# EAGLE design FemtecTester (EAGLE 6.5.0)
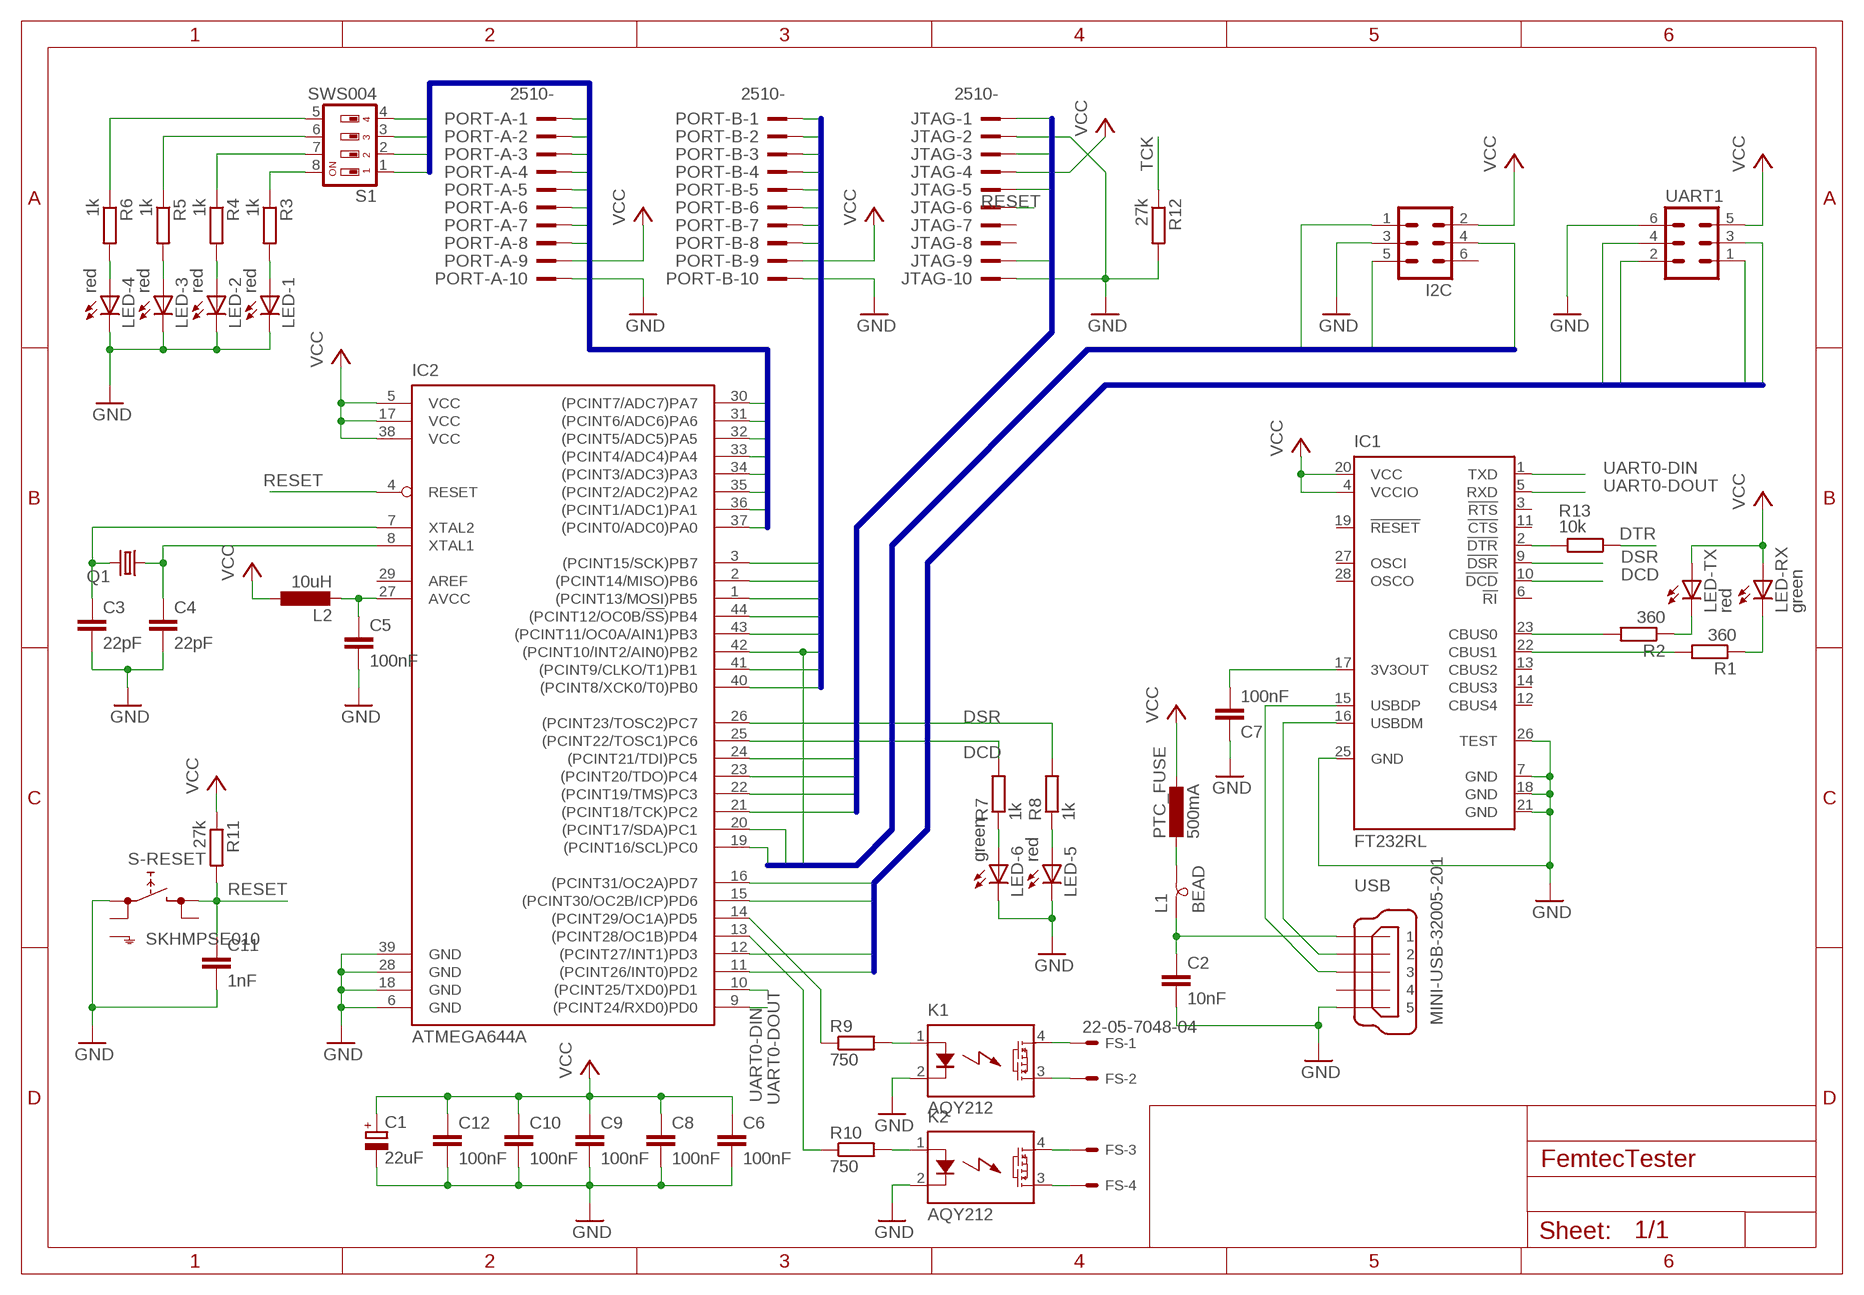
[diagram p0: schematic, sheet 1]

## Parts
C1  22uF  CPOL-EUSMCD  [SMC_D]
C2  10nF  C-EUC1206K  [C1206K]
C3  22pF  C-EUC1206K  [C1206K]
C4  22pF  C-EUC1206K  [C1206K]
C5  100nF  C-EUC1206K  [C1206K]
C6  100nF  C-EUC1206K  [C1206K]
C7  100nF  C-EUC1206K  [C1206K]
C8  100nF  C-EUC1206K  [C1206K]
C9  100nF  C-EUC1206K  [C1206K]
C10  100nF  C-EUC1206K  [C1206K]
C11  1nF  C-EUC1206K  [C1206K]
C12  100nF  C-EUC1206K  [C1206K]
FS  22-05-7048-04  [7395-04]
I2C  ML6  [ML6]
IC1  FT232RL  [SSOP28]
IC2  ATMEGA644A  [TQFP44]
JTAG  2510-  [PAK100/2500-10]
K1  AQY212  AQY2212VEHA  [SMD-DIP04]
K2  AQY212  AQY2212VEHA  [SMD-DIP04]
L1  BEAD  SM-B9  [SM-B9]
L2  10uH  L-EUL3230M  [L3230M]
LED-1  red  LEDCHIPLED_1206  [CHIPLED_1206]
LED-2  red  LEDCHIPLED_1206  [CHIPLED_1206]
LED-3  red  LEDCHIPLED_1206  [CHIPLED_1206]
LED-4  red  LEDCHIPLED_1206  [CHIPLED_1206]
LED-5  red  LEDCHIPLED_1206  [CHIPLED_1206]
LED-6  green  LEDCHIPLED_1206  [CHIPLED_1206]
LED-RX  green  LEDCHIPLED_1206  [CHIPLED_1206]
LED-TX  red  LEDCHIPLED_1206  [CHIPLED_1206]
PORT-A  2510-  [PAK100/2500-10]
PORT-B  2510-  [PAK100/2500-10]
PTC_FUSE  500mA  L-EUL1812  [L1812]
Q1  CRYSTALHC49UP  [HC49UP]
R1  360  R-EU_M1206  [M1206]
R2  360  R-EU_M1206  [M1206]
R3  1k  R-EU_M1206  [M1206]
R4  1k  R-EU_M1206  [M1206]
R5  1k  R-EU_M1206  [M1206]
R6  1k  R-EU_M1206  [M1206]
R7  1k  R-EU_M1206  [M1206]
R8  1k  R-EU_M1206  [M1206]
R9  750  R-EU_M1206  [M1206]
R10  750  R-EU_M1206  [M1206]
R11  27k  R-EU_M1206  [M1206]
R12  27k  R-EU_M1206  [M1206]
R13  10k  R-EU_M1206  [M1206]
S1  SWS004  [SMS-004]
S-RESET  SKHMPSE010  [SKHMPXE010]
UART1  ML6  [ML6]
USB  MINI-USB-32005-201  [32005-201]

## Nets
A0: IC2.37((PCINT0/ADC0)PA0) PORT-A.1
A1: IC2.36((PCINT1/ADC1)PA1) PORT-A.2
A2: IC2.35((PCINT2/ADC2)PA2) PORT-A.3
A3: IC2.34((PCINT3/ADC3)PA3) PORT-A.4
A4: IC2.33((PCINT4/ADC4)PA4) PORT-A.5 S1.1
A5: IC2.32((PCINT5/ADC5)PA5) PORT-A.6 S1.2
A6: IC2.31((PCINT6/ADC6)PA6) PORT-A.7 S1.3
A7: IC2.30((PCINT7/ADC7)PA7) PORT-A.8 S1.4
B0: IC2.40((PCINT8/XCK0/T0)PB0) PORT-B.1
B1: IC2.41((PCINT9/CLKO/T1)PB1) PORT-B.2
B2/INT: I2C.5 IC2.42((PCINT10/INT2/AIN0)PB2) PORT-B.3
B3: IC2.43((PCINT11/OC0A/AIN1)PB3) PORT-B.4
B4: IC2.44((PCINT12/OC0B/!SS!)PB4) PORT-B.5
B5: IC2.1((PCINT13/MOSI)PB5) PORT-B.6
B6: IC2.2((PCINT14/MISO)PB6) PORT-B.7
B7: IC2.3((PCINT15/SCK)PB7) PORT-B.8
CTS: IC2.16((PCINT31/OC2A)PD7) UART1.3
DCD: IC1.10(!DCD) IC2.25((PCINT22/TOSC1)PC6) R7.2
DSR: IC1.9(!DSR) IC2.26((PCINT23/TOSC2)PC7) R8.2
DTR: IC2.15((PCINT30/OC2B/ICP)PD6) R13.1 UART1.4
GND: C1.- C2.2 C3.2 C4.2 C5.2 C6.2 C7.2 C8.2 C9.2 C10.2 C11.2 C12.2 I2C.3 IC1.7(GND) IC1.18(GND) IC1.21(GND) IC1.25(GND) IC1.26(TEST) IC2.6(GND) IC2.18(GND) IC2.28(GND) IC2.39(GND) JTAG.2 JTAG.10 K1.2(K) K2.2(K) LED-1.C LED-2.C LED-3.C LED-4.C LED-5.C LED-6.C PORT-A.10 PORT-B.10 R12.2 S-RESET.1(1.1) UART1.6 USB.5
N$1: IC1.16(USBDM) USB.2
N$2: C3.1 IC2.7(XTAL2) Q1.2
N$3: IC1.15(USBDP) USB.3
N$4: C5.1 IC2.27(AVCC) L2.2
N$5: C4.1 IC2.8(XTAL1) Q1.1
N$6: C2.1 L1.1 USB.1
N$7: C7.1 IC1.17(3V3OUT)
N$8: R3.1 S1.8
N$9: R4.1 S1.7
N$10: IC1.23(CBUS0) R2.2
N$11: IC1.22(CBUS1) R1.2
N$12: LED-TX.C R2.1
N$13: LED-RX.C R1.1
N$14: R5.1 S1.6
N$15: R6.1 S1.5
N$16: LED-4.A R6.2
N$17: LED-3.A R5.2
N$18: LED-2.A R4.2
N$19: LED-1.A R3.2
N$20: IC2.13((PCINT28/OC1B)PD4) R10.1
N$23: LED-6.A R7.1
N$24: LED-5.A R8.1
N$25: IC2.14((PCINT29/OC1A)PD5) R9.1
N$26: FS.2 K1.3(DS2)
N$27: FS.1 K1.4(DS1)
N$28: K1.1(A) R9.2
N$29: K2.1(A) R10.2
N$30: L1.2 PTC_FUSE.2
N$31: FS.3 K2.4(DS1)
N$32: FS.4 K2.3(DS2)
N$33: IC1.2(!DTR) R13.2
RESET: C11.1 IC2.4(RESET) JTAG.6 R11.2 S-RESET.3(2.1)
RX: IC2.11((PCINT26/INT0)PD2) UART1.1
SCL: I2C.4 IC2.19((PCINT16/SCL)PC0)
SDA: I2C.1 IC2.20((PCINT17/SDA)PC1)
TCK: IC2.21((PCINT18/TCK)PC2) JTAG.1 R12.1
TDI: IC2.24((PCINT21/TDI)PC5) JTAG.9
TDO: IC2.23((PCINT20/TDO)PC4) JTAG.3
TMS: IC2.22((PCINT19/TMS)PC3) JTAG.5
TX: IC2.12((PCINT27/INT1)PD3) UART1.2
UART0-DIN: IC1.1(TXD) IC2.9((PCINT24/RXD0)PD0)
UART0-DOUT: IC1.5(RXD) IC2.10((PCINT25/TXD0)PD1)
VCC: C1.+ C6.1 C8.1 C9.1 C10.1 C12.1 I2C.2 IC1.4(VCCIO) IC1.20(VCC) IC2.5(VCC) IC2.17(VCC) IC2.38(VCC) JTAG.4 L2.1 LED-RX.A LED-TX.A PORT-A.9 PORT-B.9 PTC_FUSE.1 R11.1 UART1.5
Unconnected: I2C.6 IC1.3(!RTS) IC1.6(!RI) IC1.11(!CTS) IC1.12(CBUS4) IC1.13(CBUS2) IC1.14(CBUS3) IC1.19(!RESET) IC1.27(OSCI) IC1.28(OSCO) IC2.29(AREF) JTAG.7 JTAG.8 S-RESET.2(1.2) S-RESET.4(2.2) S-RESET.5(SH) USB.4

## Buses
A[0..7]
B0,B1,B2/INT,B3,B4,B5,B6,B7
TCK,TDO,TMS,TDI
SDA,SCL,B2/INT
RX,TX,CTS,DTS,DTR

## Library data of the parts
C1 = rcl:CPOL-EU: POLARIZED CAPACITOR, European symbol
C2-C12 = rcl:C-EU: CAPACITOR, European symbol
FS = con-molex:22-?-04: CONNECTOR wire to board 2.54 mm (.1 inch) pitch header; OC_FARNELL: unknown; OC_NEWARK: unknown
I2C UART1 = con-harting-ml:ML6: HARTING; OC_FARNELL: unknown; OC_NEWARK: unknown
IC1 = ftdichip:FT232R: Source: http://www.ftdichip.com/Documents/DataSheets/DS_FT232R_v104.pdf; MPN: FT232RL; OC_FARNELL: 1146032; OC_NEWARK: 91K9918
IC2 = atmel:ATMEGA644: 8-bit Microcontroller with 64K Bytes In-System Programmable Flash Source: http://www.atmel.com/dyn/resources/prod_documents/doc2593.pdf; MPN: ATMEGA644PV-10AU; OC_FARNELL: 1455123; OC_NEWARK: 58M3748
JTAG PORT-A PORT-B = con-3m:2510-: 3M (TM) Pak 100 4-Wall Header Source: 3M; MF: 3M; MPN: 2510-6002UB; OC_FARNELL: 9838244; OC_NEWARK: 46F4725
K1 K2 = tpv:AQY221*2V: PHOTOMOS Relay RF (Radio Frequency) NAiS C . R 10 SSOP Type; Source: http://www.mew-europe.com/.. aqy221_2v.pdf
L1 = inductor-neosid:SM-B: INDUCTOR SMD Bead inductor; OC_FARNELL: unknown; OC_NEWARK: unknown
L2 PTC_FUSE = rcl:L-EU: INDUCTOR, European symbol
LED-1-LED-6 LED-RX LED-TX = led:LED: LED OSRAM: - CHIPLED LG R971, LG N971, LY N971, LG Q971, LY Q971, LO R971, LY R971 LH N974, LH R974 LS Q976, LO Q976, LY Q976 LO Q996 - Hyper CHIPLED LW Q18S LB Q993, LB Q99A, LB R99A - SideLED LS A670, LO A670, LY A670, LG A670, LP A670 LB A673, LV A673, LT A673, LW A673 LH A674 LY A675 LS A676, LA A676, LO A676, LY A676, LW A676 LS A679, LY A679, LG A679 - Hyper Micro SIDELED® LS Y876, LA Y876, LO Y876, LY Y876 LT Y87S - SmartLED LW L88C, LW L88S LB L89C, LB L89S, LG L890 LS L89K, LO L89K, LY L89K LS L896, LA L896, LO L896, LY L896 - TOPLED LS T670, LO T670, LY T670, LG T670, LP T670 LSG T670, LSP T670, LSY T670, LOP T670, LYG T670 LG T671, LOG T671, LSG T671 LB T673, LV T673, LT T673, LW T673 LH T674 LS T676, LA T676, LO T676, LY T676, LB T676, LH T676, LSB T676, LW T676 LB T67C, LV T67C, LT T67C, LS T67K, LO T67K, LY T67K, LW E67C LS E67B, LA E67B, LO E67B, LY E67B, LB E67C, LV E67C, LT E67C LW T67C LS T679, LY T679, LG T679 LS T770, LO T770, LY T770, LG T770, LP T770 LB T773, LV T773, LT T773, LW T773 LH T774 LS E675, LA E675, LY E675, LS T675 LS T776, LA T776, LO T776, LY T776, LB T776 LHGB T686 LT T68C, LB T68C - Hyper Mini TOPLED® LB M676 - Mini TOPLED Santana® LG M470 LS M47K, LO M47K, LY M47K Source: http://www.osram.convergy.de LUXEON: - LUMILED® LXK2-PW12-R00, LXK2-PW12-S00, LXK2-PW14-U00, LXK2-PW14-V00 LXK2-PM12-R00, LXK2-PM12-S00, LXK2-PM14-U00 LXK2-PE12-Q00, LXK2-PE12-R00, LXK2-PE12-S00, LXK2-PE14-T00, LXK2-PE14-U00 LXK2-PB12-K00, LXK2-PB12-L00, LXK2-PB12-M00, LXK2-PB14-N00, LXK2-PB14-P00, LXK2-PB14-Q00 LXK2-PR12-L00, LXK2-PR12-M00, LXK2-PR14-Q00, LXK2-PR14-R00 LXK2-PD12-Q00, LXK2-PD12-R00, LXK2-PD12-S00 LXK2-PH12-R00, LXK2-PH12-S00 LXK2-PL12-P00, LXK2-PL12-Q00, LXK2-PL12-R00 Source: www.luxeon.com KINGBRIGHT: KA-3528ASYC Source: www.kingbright.com
Q1 = crystal:CRYSTAL: CRYSTAL; OC_FARNELL: unknown; OC_NEWARK: unknown
R1-R13 = rcl:R-EU_: RESISTOR, European symbol
S1 = smd-special:SWS004: SMD Dip Switch 4 pol.
S-RESET = switch:SKHMP*E010: 6.2 X 6.5mm TACT Switch (SMD) Source: http://www3.alps.co.jp/WebObjects/catalog.woa/PDF/E/Switch/Tact/SKHM/SKHM.PDF
USB = con-cypressindustries:MINI-USB-: MINI USB-B Conector Source: www.cypressindustries.com; OC_FARNELL: unknown; OC_NEWARK: unknown

## Board
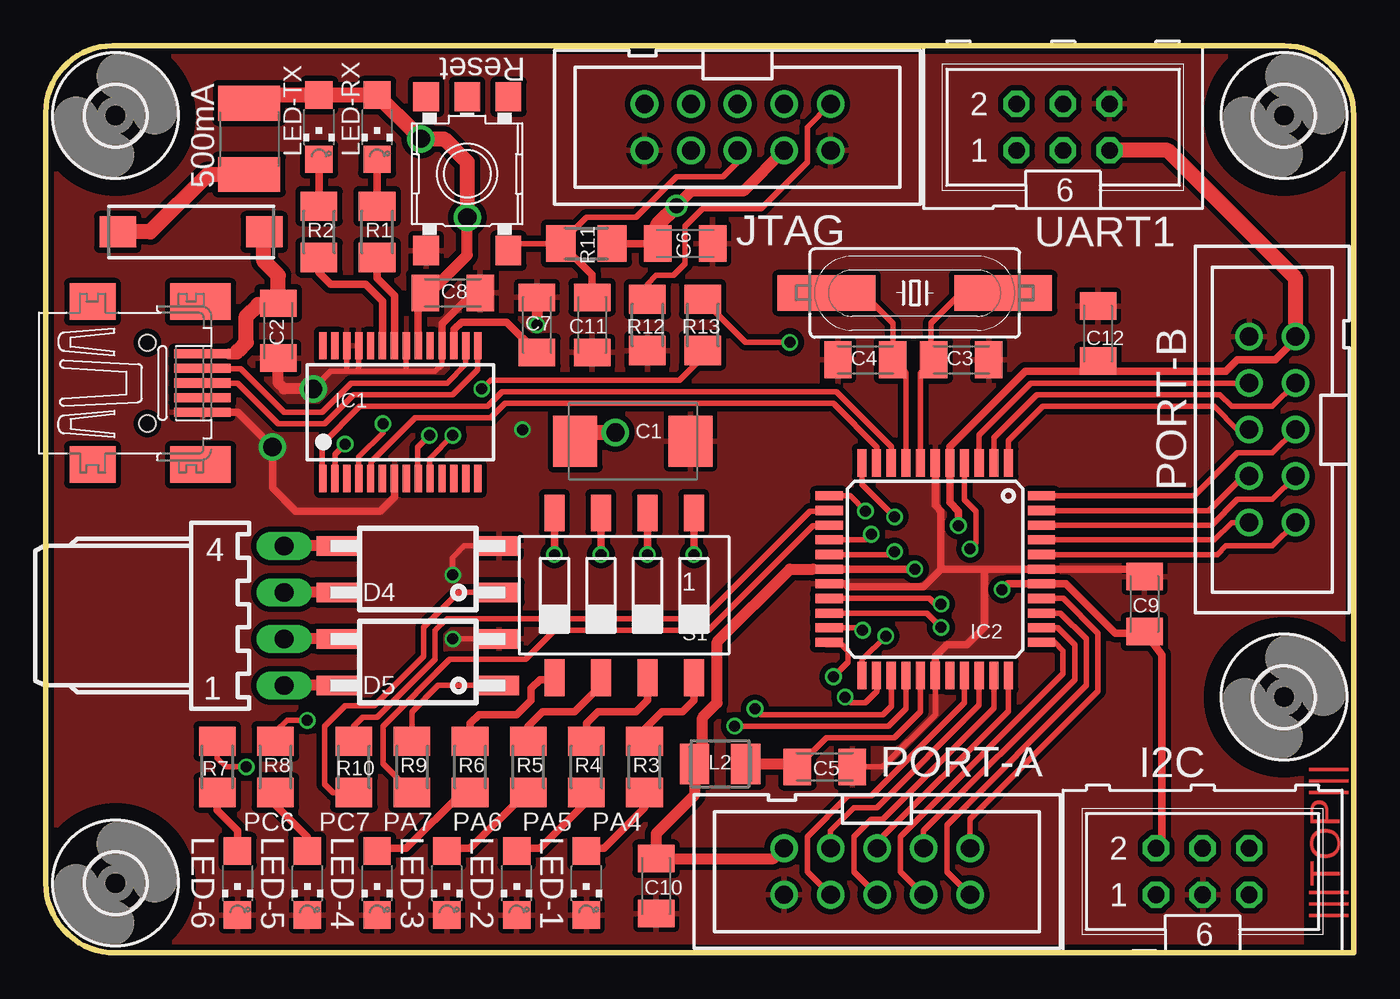
[diagram p1: board, top side]
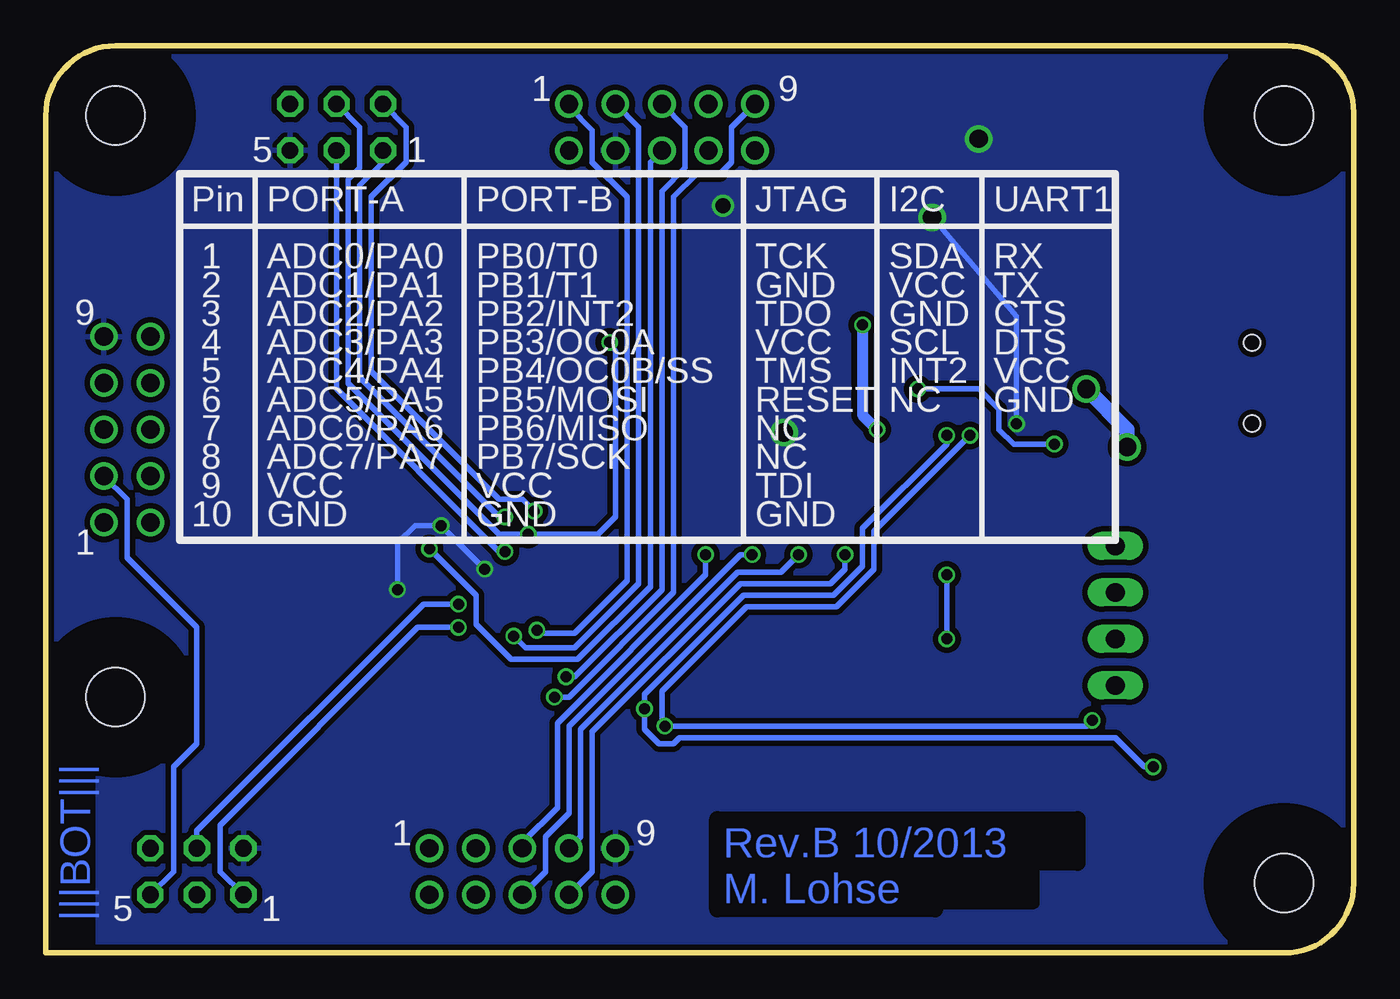
[diagram p2: board, bottom side, seen from below]

Size 71.44 x 49.53 mm. Coordinates in mm from the lower left corner, seen from the top.
Outline: 0,3.81 arc90 3.81,0 71.44,0 71.44,45.72 arc90 67.63,49.53 3.65,49.53 arc90 0,45.88 0,3.81
Copper layers (1*16): Top 0.035mm / dielectric 1.5mm / Bottom 0.035mm
Design rules "ITEADstudio_DRC": minimum track width 6mil, minimum drill 12mil, track to track 6mil, track to pad 6mil, pad to pad 6mil, via to via 6mil, smd to smd 0mil, copper to edge 10mil, drill to drill 10mil, minimum pad ring 10mil, minimum via ring 6mil, stop-mask expansion 2mil, vias tented up to drill 100mil, thermal gap 10mil
bRestrict: 6 lines

### Footprints (pad centres in the part's own frame; a part is rotated, then mirrored left to right if it is on the bottom)
SMC_D = smd 2.4 x 2.8: + -3.15,0; - 3.15,0
C1206K = smd 1.5 x 2: 1 -1.5,0; 2 1.5,0
7395-04 = drill 1.016 long: 1 3.81,0; 2 1.27,0; 3 -1.27,0; 4 -3.81,0
ML6 = drill 0.914 octagon: 1 -2.54,-1.27; 2 -2.54,1.27; 3 0,-1.27; 4 0,1.27; 5 2.54,-1.27; 6 2.54,1.27
SSOP28 = smd 0.4 x 1.5: 1 -4.225,-3.625; 2 -3.575,-3.625; 3 -2.925,-3.625; 4 -2.275,-3.625; 5 -1.625,-3.625; 6 -0.975,-3.625; 7 -0.325,-3.625; 8 0.325,-3.625; 9 0.975,-3.625; 10 1.625,-3.625; 11 2.275,-3.625; 12 2.925,-3.625; 13 3.575,-3.625; 14 4.225,-3.625; 15 4.225,3.625; 16 3.575,3.625; 17 2.925,3.625; 18 2.275,3.625; 19 1.625,3.625; 20 0.975,3.625; 21 0.325,3.625; 22 -0.325,3.625; 23 -0.975,3.625; 24 -1.625,3.625; 25 -2.275,3.625; 26 -2.925,3.625; 27 -3.575,3.625; 28 -4.225,3.625
TQFP44 = smd 1.5 x 0.5: 1 -5.8,4; 2 -5.8,3.2; 3 -5.8,2.4; 4 -5.8,1.6; 5 -5.8,0.8; 6 -5.8,0; 7 -5.8,-0.8; 8 -5.8,-1.6; 9 -5.8,-2.4; 10 -5.8,-3.2; 11 -5.8,-4; 23 5.8,-4; 24 5.8,-3.2; 25 5.8,-2.4; 26 5.8,-1.6; 27 5.8,-0.8; 28 5.8,0; 29 5.8,0.8; 30 5.8,1.6; 31 5.8,2.4; 32 5.8,3.2; 33 5.8,4 | smd 0.5 x 1.5: 12 -4,-5.8; 13 -3.2,-5.8; 14 -2.4,-5.8; 15 -1.6,-5.8; 16 -0.8,-5.8; 17 0,-5.8; 18 0.8,-5.8; 19 1.6,-5.8; 20 2.4,-5.8; 21 3.2,-5.8; 22 4,-5.8; 34 4,5.8; 35 3.2,5.8; 36 2.4,5.8; 37 1.6,5.8; 38 0.8,5.8; 39 0,5.8; 40 -0.8,5.8; 41 -1.6,5.8; 42 -2.4,5.8; 43 -3.2,5.8; 44 -4,5.8
PAK100/2500-10 = drill 1 pad 1.422: 1 -5.08,-1.27; 2 -5.08,1.27; 3 -2.54,-1.27; 4 -2.54,1.27; 5 0,-1.27; 6 0,1.27; 7 2.54,-1.27; 8 2.54,1.27; 9 5.08,-1.27; 10 5.08,1.27
SMD-DIP04 = smd 2.184 x 1.067: 1 -4.445,1.27; 2 -4.445,-1.27; 3 4.445,-1.27; 4 4.445,1.27
SM-B9 = smd 2 x 1.7: 1 -4,0; 2 4,0
L3230M = smd 1.6 x 2.2: 1 -1.4,0; 2 1.4,0
CHIPLED_1206 = smd 1.5 x 1.5: A 0,-1.75; C 0,1.75
L1812 = smd 1.9 x 3.4: 1 -1.95,0; 2 1.95,0
HC49UP = smd 5.334 x 1.93: 1 -4.826,0; 2 4.826,0
M1206 = smd 1.6 x 2: 1 -1.4,0; 2 1.4,0
SMS-004 = smd 1.092 x 2.007: 1 -3.81,-4.496; 2 -1.27,-4.496; 3 1.27,-4.496; 4 3.81,-4.496; 5 3.81,4.496; 6 1.27,4.496; 7 -1.27,4.496; 8 -3.81,4.496
SKHMPXE010 = smd 1.6 x 1.4: 1 -4.2,2.25; 2 4.2,2.25; 3 -4.2,-2.25; 4 4.2,-2.25; 5 4.2,0
3,2 = hole 3.2: 0,0
32005-201 = smd 3.1 x 0.5: 1 3,1.6; 2 3,0.8; 3 3,0; 4 3,-0.8; 5 3,-1.6 | smd 2.5 x 2: M1 -3,-4.45; M2 -3,4.45 | smd 3.3 x 2: M3 2.9,4.45; M4 2.9,-4.45 | hole 0.9: 0,2.2; 0,-2.2

### Placement (x,y rotation side)
C1  32.07,27.94 0 top
C2  12.7,33.97 270 top
C3  50.01,32.38 0 top
C4  44.77,32.38 180 top
C5  42.54,10.16 0 top
C6  34.92,38.73 0 top
C7  26.83,34.29 90 top
C8  22.23,36.04 0 top
C9  60.01,19.05 90 top
C10  33.34,3.65 270 top
C11  29.85,34.29 270 top
C12  57.47,33.81 90 top
FS  13.02,18.41 270 top
I2C  63.18,4.45 0 top
IC1  19.37,29.53 0 top
IC2  48.58,20.95 270 top
JTAG  37.78,45.09 180 top
K1  20.32,15.88 180 top
K2  20.32,20.95 180 top
L1  7.94,39.37 180 top
L2  36.83,10.32 0 top
LED-1  29.53,3.81 180 top
LED-2  25.72,3.81 180 top
LED-3  21.91,3.81 180 top
LED-4  18.1,3.81 180 top
LED-5  14.29,3.81 180 top
LED-6  10.48,3.81 180 top
LED-RX  18.1,45.09 180 top
LED-TX  14.92,45.09 180 top
PORT-A  45.4,4.45 180 top
PORT-B  66.99,28.57 90 top
PTC_FUSE  11.11,44.45 270 top
Q1  47.47,36.04 0 top
R1  18.1,39.37 270 top
R2  14.92,39.37 270 top
R3  32.7,10.16 270 top
R4  29.53,10.16 270 top
R5  26.35,10.16 270 top
R6  23.18,10.16 270 top
R7  9.37,10.16 90 top
R8  12.54,10.16 90 top
R9  20,10.16 90 top
R10  16.83,10.16 270 top
R11  29.53,38.73 180 top
R12  32.86,34.29 270 top
R13  35.88,34.29 270 top
S1  31.59,19.53 180 top
S-RESET  23.02,42.55 90 top
U$1  [3,2]  3.81,3.81 0 top
U$2  [3,2]  67.63,13.97 0 top
U$3  [3,2]  67.63,45.72 0 top
U$4  [3,2]  3.81,45.72 0 top
UART1  55.56,45.09 0 top
USB  5.56,31.11 0 top

### Tracks (layer width: path | path; a pad name or v marks a point on that pad's centre or on a via)
A0
  Top 0.305: IC2.37 55.57,19.36 57.47,17.46 57.47,14.29 50.48,7.3 PORT-A.1
A1
  Top 0.305: IC2.36 55.42,18.55 56.83,17.14 56.83,14.61 49.21,6.99 49.21,4.45 PORT-A.2
A2
  Top 0.305: IC2.35 55.27,17.75 56.2,16.83 56.2,14.92 47.94,6.67 PORT-A.3
A3
  Top 0.305: IC2.34 55.12,16.95 55.56,16.51 55.56,15.24 46.67,6.35 46.67,4.45 PORT-A.4
A4  (via drill 0.6)
  Top 0.305: IC2.33 52.58,13.21 45.4,6.03 PORT-A.5
  Top 0.406: S1.1 v35.4,21.75
  Bottom 0.305: v35.4,21.75 35.4,20.64 43.5,12.54 43.5,7.94 45.4,6.03 PORT-A.5
A5  (via drill 0.6)
  Top 0.305: IC2.32 51.78,13.36 45.72,7.3 45.09,7.3 44.13,6.35 44.13,4.45 PORT-A.6
  Top 0.406: S1.2 v32.86,21.75
  Bottom 0.305: v32.86,21.75 33.5,21.75 42.86,12.38 42.86,7.62 44.13,6.35 44.13,4.45 PORT-A.6
A6  (via drill 0.6)
  Top 0.305: IC2.31 50.98,13.51 45.4,7.94 44.13,7.94 42.86,6.67 PORT-A.7
  Top 0.406: S1.3 v30.32,21.75
  Bottom 0.305: v30.32,21.75 31.27,20.8 33.65,20.8 42.23,12.22 42.23,6.35 PORT-A.7
A7  (via drill 0.6)
  Top 0.305: IC2.30 50.18,13.66 45.09,8.57 43.82,8.57 41.59,6.35 41.59,4.45 PORT-A.8
  Top 0.406: S1.4 v27.78,21.75
  Bottom 0.305: v27.78,21.75 27.78,20.95 28.57,20.16 33.5,20.16 41.59,12.06 41.59,4.45 PORT-A.8
B0
  Top 0.305: IC2.40 63.98,21.75 64.45,22.23 66.99,22.23 PORT-B.1
B1
  Top 0.305: IC2.41 63.83,22.55 64.77,23.5 PORT-B.2
B2/INT
  Top 0.305: IC2.42 63.68,23.36 65.09,24.77 66.99,24.77 PORT-B.3
  Bottom 0.305: I2C.5 64.45,4.45 64.45,10.16 63.18,11.43 63.18,17.78 66.99,21.59 66.99,24.77 PORT-B.3
B3
  Top 0.305: IC2.43 63.53,24.16 65.4,26.04 PORT-B.4
B4
  Top 0.305: IC2.44 62.74,24.95 65.09,27.3 66.99,27.3 PORT-B.5
B5
  Top 0.305: IC2.1 52.58,27.97 54.45,29.84 63.82,29.84 65.09,28.57 PORT-B.6
B6
  Top 0.305: IC2.2 51.78,28.12 54.13,30.48 64.14,30.48 64.77,29.84 66.99,29.84 PORT-B.7
B7
  Top 0.305: IC2.3 50.98,28.28 53.82,31.11 PORT-B.8
CTS  (via drill 0.6)
  Top 0.305: IC2.16 46.2,21.75 v46.35,21.91
  Bottom 0.305: v46.35,21.91 46.67,21.91 55.56,30.8 UART1.3
DCD  (via drill 0.6)
  Top 0.305: IC2.25 46.18,13.47 45.72,13.02 39.05,13.02 v38.74,13.34 | 9.37,12.22 R7.2 9.37,10.64 9.84,10.16 v10.95,10.16 | IC1.10 20.96,25.94 20.96,26.99 v22.23,28.26
  Bottom 0.305: v22.23,28.26 22.23,27.78 26.83,23.18 26.83,21.11 28.42,19.53 33.34,19.53 38.74,14.13 v38.74,13.34 38.74,12.22 37.94,11.43 37.15,11.43 36.83,11.75 13.02,11.75 11.43,10.16 v10.95,10.16
DSR  (via drill 0.6)
  Top 0.305: IC2.26 46.98,13.32 46.04,12.38 v37.62,12.38 | v20.96,28.26 20.32,27.62 20.32,25.93 IC1.9 | R8.2 12.54,12.06 13.18,12.7 v14.29,12.7
  Bottom 0.305: v20.96,28.26 26.19,23.02 26.19,20.95 28.26,18.89 33.18,18.89 37.78,14.29 37.78,12.7 v37.62,12.38 14.6,12.38 v14.29,12.7
DTR  (via drill 0.6)
  Top 0.305: IC2.15 44.78,22.55 v45.09,22.86 | v40.64,33.34 38.23,33.34 35.85,35.72 35.88,35.72 R13.1
  Bottom 0.305: UART1.4 54.29,45.09 54.29,42.86 54.93,42.23 54.93,31.11 46.67,22.86 v45.09,22.86 41.28,22.86 40.32,23.81 40.32,32.86 v40.64,33.34
GND  (via drill 0.6, 1 pad 1.02)
  Top 0.305: 51.75,32.62 C3.2 | 12.7,32.07 C2.2 | 48.58,15.24 48.58,13.02 45.72,10.16 C5.2 | 19.69,31.75 21.27,31.75 21.64,32.12 IC1.18 | 19.69,31.75 IC1.21 | 19.69,31.75 16.99,31.75 | 16.99,31.75 16.35,31.75 | 16.35,31.75 15.56,31.75 v14.6,30.8 | IC1.26 16.44,31.84 16.35,31.75 | IC1.25 17.09,31.86 16.99,31.75 | 23.25,35.72 C8.2 | K2.2 22.86,22.23 22.23,21.59 v22.23,20.64 | v22.23,17.14 K1.2
  Top 0.406: USB.5 10.49,29.52 v12.38,27.62 12.38,25.4 13.65,24.13 18.26,24.13 19.04,24.92 IC1.7 | IC2.28 48.58,15.24 48.58,16.19 49.21,16.83 50.32,16.83 51.28,17.78 51.28,20.95 | 60.41,20.55 C9.2 59.28,20.95 IC2.39 51.28,20.95 | IC1.18 21.64,34.34 23.02,35.72 23.25,35.72 | IC2.6 48.58,24.45 48.89,24.13 48.89,20.95 | 48.89,20.95 51.28,20.95 | IC2.18 43.66,20.16 43.82,20 47.94,20 48.89,20.95
  Top 0.61: v14.6,30.8 13.02,30.8 12.7,31.11 12.7,32.07 | C7.2 v26.83,34.29
  Bottom 0.305: v22.23,20.64 v22.23,17.14
  Bottom 0.61: v26.83,34.29 26.83,29.37 v26.03,28.57
  Bottom 0.813: v14.6,30.8 12.38,28.57 v12.38,27.62
  pour Top (isolate 0.305): 0,0 71.44,0 71.44,49.53 0,49.53
N$1
  Top 0.305: IC1.16 22.94,32.15 21.91,31.11 16.67,31.11 15.08,29.53 13.02,29.53 10.64,31.91 8.4,31.91 USB.2
N$2
  Top 0.305: IC2.7 47.78,31.66 C3.1 48.35,32.54 48.35,34.38 50.32,36.35 Q1.2
N$3
  Top 0.305: IC1.15 23.59,31.85 22.23,30.48 16.83,30.48 15.24,28.89 12.7,28.89 10.48,31.11 USB.3
N$4
  Top 0.305: IC2.27 47.78,13.17 46.35,11.75 42.63,11.75 C5.1
  Top 0.61: L2.2 40.89,10.32 C5.1
N$5
  Top 0.305: IC2.8 46.98,31.68 C4.1 46.27,34.38 44.29,36.35 Q1.1
N$6
  Top 0.305: USB.1 10,32.7 | C2.1 12.47,35.24
  Top 0.61: 10,32.7 10.48,32.7 10.48,32.86
  Top 0.813: 10.48,32.86 10.95,33.34 10.95,34.77 11.59,35.4 12.63,35.4 C2.1 12.7,36.99 11.91,37.78 11.91,39.34 L1.1
N$7
  Top 0.406: IC1.17 22.29,34.04 22.7,34.45 25.17,34.45 C7.1
N$8
  Top 0.406: S1.8 35.4,13.81 34.77,13.18 33.65,13.18 32.7,12.22 R3.1
N$9
  Top 0.406: S1.7 32.86,13.81 32.23,13.18 30.16,13.18 29.53,12.54 R4.1
N$10
  Top 0.305: R2.2 14.92,37.78
  Top 0.406: R2.2 14.92,37.15 15.56,36.51 17.46,36.51 18.39,35.58 IC1.23
N$11
  Top 0.406: R1.2 18.1,36.83 19.04,35.88 IC1.22
N$12
  Top 0.406: R2.1 LED-TX.C
N$13
  Top 0.406: R1.1 LED-RX.C
N$14
  Top 0.406: S1.6 30.32,14.61 28.89,13.18 27.15,13.18 26.35,12.38 R5.1
N$15
  Top 0.406: R6.1 23.18,12.54 23.65,13.02 25.72,13.02 26.51,13.81 26.51,14.45 26.99,14.92 27.67,14.92 S1.5
N$16
  Top 0.305: 18.25,5.71 LED-4.A
  Top 0.406: R6.2 22.73,8.76 19.69,5.71 18.25,5.71
N$17
  Top 0.305: R5.2 26.22,8.76 | 22.06,5.71 LED-3.A
  Top 0.406: 26.22,8.76 23.18,5.71 22.06,5.71
N$18
  Top 0.305: R4.2 29.53,8.26 | 25.87,5.71 LED-2.A
  Top 0.406: 29.53,8.26 26.99,5.71 25.87,5.71
N$19
  Top 0.305: 29.68,5.71 LED-1.A
  Top 0.406: R3.2 32.7,7.94 30.48,5.71 29.68,5.71
N$20
  Top 0.305: R10.1 16.83,12.38 17.3,12.86 18.1,12.86 21.27,16.03 21.27,17.62 21.91,18.26 35.88,18.26 41.75,24.13 42.75,24.13
  Top 0.406: 42.75,24.13 IC2.13
N$23
  Top 0.406: LED-6.A 10.48,6.67 9.37,7.78 R7.1
N$24
  Top 0.406: LED-5.A 14.29,6.35 12.54,8.1 R8.1
N$25
  Top 0.305: 19.97,8.76 18.42,10.32 18.42,12.38 22.07,16.03 26.19,16.03 27.78,17.62 36.2,17.62 41.91,23.34 42.76,23.34
  Top 0.406: R9.1 19.97,8.76 | 42.76,23.34 IC2.14
N$26
  Top 0.61: K1.3 FS.2
N$27
  Top 0.61: K1.4 FS.1
N$28
  Top 0.305: R9.2 20,13.18 21.43,14.61 K1.1
N$29
  Top 0.305: R10.2 15.69,8.76 15.24,9.21 15.24,12.38 16.35,13.49 17.94,13.49 20.64,16.19 20.64,17.78 22.54,19.68 K2.1
N$30
  Top 0.813: PTC_FUSE.2 8.84,42.5 5.71,39.37 L1.2
N$31
  Top 0.61: K2.4 FS.3
N$32
  Top 0.61: K2.3 FS.4
N$33  (via drill 0.6)
  Top 0.305: v23.81,30.8 24.29,31.27 34.61,31.27 35.59,32.26 R13.2 | v16.35,27.78 15.79,27.22 IC1.2
  Bottom 0.305: v23.81,30.8 20.48,30.8 19.37,29.69 19.37,28.57 18.57,27.78 v16.35,27.78
RESET  (via drill 0.6)
  Top 0.305: S-RESET.3 25.4,38.32 25.56,38.58 25.91,38.73 R11.2 28.13,38.76 29.53,40.16 32.23,40.16 34.45,42.39 36.99,42.39 37.78,43.18 JTAG.6 | IC2.4 50.18,24.75 50.8,24.13 50.8,22.38 v50.48,22.07
  Top 0.406: C11.1 29.85,37.02 R11.2
  Bottom 0.305: JTAG.6 38.42,43.18 38.42,20 42.39,16.03 46.04,16.03 47.94,17.94 47.94,19.53 v50.48,22.07
RX  (via drill 0.6)
  Top 0.305: IC2.11 44.58,25.59 v46.35,23.81
  Bottom 0.305: v46.35,23.81 46.67,23.81 54.29,31.43 54.29,41.91 53.02,43.18 UART1.1
SCL  (via drill 0.6)
  Top 0.305: IC2.19 48.27,19.36 48.58,19.05 v48.89,19.05
  Bottom 0.305: v48.89,19.05 50.8,19.05 63.18,6.67 I2C.4
SDA  (via drill 0.6)
  Top 0.305: IC2.20 48.12,18.55 v48.89,17.78
  Bottom 0.305: v48.89,17.78 51.12,17.78 61.91,6.99 61.91,4.45 I2C.1
TCK  (via drill 0.6)
  Top 0.305: JTAG.1 41.59,45.09 41.59,43.18 39.05,40.64 35.88,40.64 34.92,39.69 34.92,37.62 34.29,36.99 33.34,36.99 32.86,36.51 R12.1 | IC2.21 44.47,17.75 v44.61,17.62
  Bottom 0.305: v44.61,17.62 44.45,17.46 42.54,17.46 39.69,20.32 39.69,41.27 41.59,43.18 41.59,44.93 42.86,46.2 JTAG.1
TDI  (via drill 0.6)
  Top 0.305: v43.66,13.97 43.97,13.65 44.77,13.65 45.4,14.29 45.4,15.13 IC2.24
  Bottom 0.305: v43.66,13.97 42.86,13.97 37.15,19.68 37.15,41.27 35.88,42.55 34.61,42.55 33.97,43.18 33.97,45.09 JTAG.9
TDO  (via drill 0.6)
  Top 0.305: IC2.23 44.58,16 v45.88,17.3
  Bottom 0.305: v45.88,17.3 45.24,16.67 42.54,16.67 39.05,20.16 39.05,45.09 JTAG.3
TMS  (via drill 0.6)
  Top 0.305: IC2.22 42.65,16.83 43.5,16.83 43.82,16.51 43.82,15.88 v43.02,15.08
  Bottom 0.305: v43.02,15.08 42.54,15.08 37.78,19.84 37.78,41.59 36.51,42.86 36.51,45.09 JTAG.5
TX  (via drill 0.6)
  Top 0.305: IC2.12 43.94,24.95 v44.77,24.13
  Bottom 0.305: v44.77,24.13 45.4,24.77 46.67,24.77 53.66,31.75 53.66,41.27 51.75,43.18 51.75,45.09 UART1.2
UART0-DIN
  Top 0.305: IC2.9 46.18,27.64 43.18,30.64 24.92,30.64 24.13,29.84 17.14,29.84 15.08,27.78 15.08,25.96 IC1.1
UART0-DOUT
  Top 0.305: IC2.10 45.4,26.78 45.4,27.62 43.02,30 25.08,30 24.29,29.21 20.16,29.21 17.78,26.83 17.78,25.94 IC1.5
VCC  (via drill 0.6, 0.8, 1 pad 1.02)
  Top 0.305: 11.55,46.84 PTC_FUSE.1 | IC1.4 17.09,27.09 18.42,28.42 v18.42,28.89
  Top 0.406: v47.47,20.95 IC2.17 41.91,20.95 | v49.85,23.34 49.85,24.13 49.38,24.6 IC2.5 49.38,27.63 53.5,31.75 56.9,31.75 | v52.23,19.84 52.54,20.16 IC2.38 55.73,20.16 58.42,17.46 59.92,17.46 C9.1 60.96,16.28 60.96,6.03 I2C.2 | 35.88,11.11 L2.1 | PORT-B.9 68.26,33.5 67.15,32.38 65.09,32.38 64.45,31.75 56.9,31.75 | 56.9,31.75 C12.1 | 31.24,38.45 R11.1 33.34,38.73 33.42,38.66 33.74,38.66 | 20.96,36.04 C8.1 20.34,35.81 IC1.20
  Top 0.61: 20.16,44.77 v20.48,44.45 | JTAG.4 38.1,41.59 35.24,41.59 v34.45,40.8 | 20.96,36.04 23.02,38.1 v23.02,40.16 | C6.1 33.74,38.66 | 35.88,11.11 35.88,12.86 36.67,13.65 36.67,16.99 40.64,20.95 41.91,20.95 | PORT-A.9 39.76,5.15 C10.1 33.34,6.51 35.43,8.6 L2.1
  Top 0.813: 11.55,46.84 LED-TX.A LED-RX.A 20.16,44.77 | v20.48,44.45 21.75,44.45 23.02,43.18 v23.02,40.16 | PORT-B.9 68.26,36.83 61.28,43.81 UART1.5 | v31.12,28.42 29.39,28.42 C1.+ | 31.27,38.76 R11.1 | C6.1 33.42,39.77 v34.45,40.8
  Bottom 0.305: v47.47,20.95 v49.85,23.34 51.28,23.34 52.23,22.38 v52.23,19.84 | v18.42,28.89 18.42,34.77 v23.02,40.16
  pour Bottom (isolate 0.305): 0,0 arc90 0.16,-0.16 3.81,-0.16 71.44,0 71.44,49.53 0,49.53

### Text on the board
Top: |||TOP|||
Bottom: |||BOT||| | Rev.B 10/2013 / M. Lohse
tPlace: D4 | D5 | PC6 | PC7 | PA7 | PA6 | PA5 | PA4
bPlace: 9 | 1 | 1 | 5 | UART1 / / RX / TX / CTS / DTS / VCC / GND | I2C / / SDA / VCC / GND / SCL / INT2 / NC | JTAG / / TCK / GND / TDO / VCC / TMS / RESET / NC / NC / TDI / GND | PORT-B / / PB0/T0 / PB1/T1 / PB2/INT2 / PB3/OC0A / PB4/OC0B/SS / PB5/MOSI / PB6/MISO / PB7/SCK / VCC / GND | PORT-A / / ADC0/PA0 / ADC1/PA1 / ADC2/PA2 / ADC3/PA3 / ADC4/PA4 / ADC5/PA5 / ADC6/PA6 / ADC7/PA7 / VCC / GND | Pin / / 1 / 2 / 3 / 4 / 5 / 6 / 7 / 8 / 9 / 10 | 9 | 1 | 9 | 1 | 1 | 5
tNames: Reset | 500mA